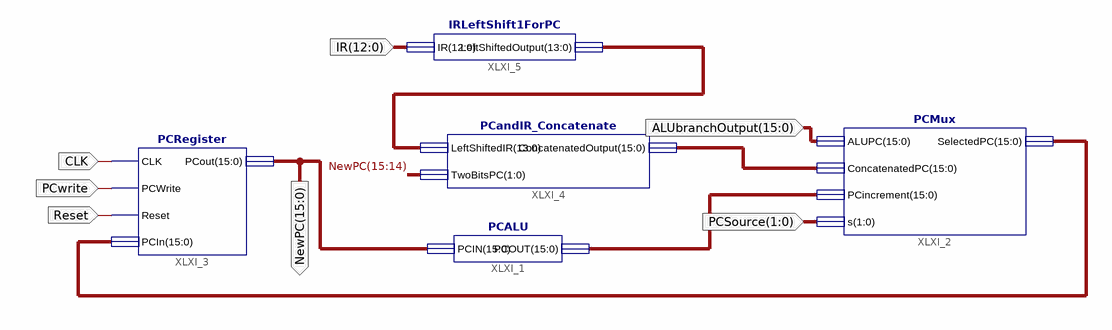
[diagram p0: schematic sheet 1]
// Xilinx ISE schematic FullSubsystem.sch (spartan3e) as structural Verilog: 5 symbols, 8 ports
module FullSubsystem (
  input  [12:0] IR,
  input  [1:0] PCSource,
  input  [15:0] ALUbranchOutput,
  input  CLK,
  input  PCwrite,
  input  Reset,
  output [15:0] NewPC
);

  wire [13:0] XLXN_5;
  wire [15:0] SelectedPC, XLXN_4, XLXN_6;

  PCALU XLXI_1 (.PCIN(NewPC), .PCOUT(XLXN_4));
  PCMux XLXI_2 (
    .ALUPC(ALUbranchOutput), .ConcatenatedPC(XLXN_6), .PCincrement(XLXN_4), .s(PCSource),
    .SelectedPC(SelectedPC));
  PCRegister XLXI_3 (.CLK(CLK), .PCWrite(PCwrite), .Reset(Reset), .PCIn(SelectedPC), .PCout(NewPC));
  PCandIR_Concatenate XLXI_4 (.LeftShiftedIR(XLXN_5), .TwoBitsPC(NewPC[15:14]), .ConcatenatedOutput(XLXN_6));
  IRLeftShift1ForPC XLXI_5 (.IR(IR), .LeftShiftedOutput(XLXN_5));
endmodule
